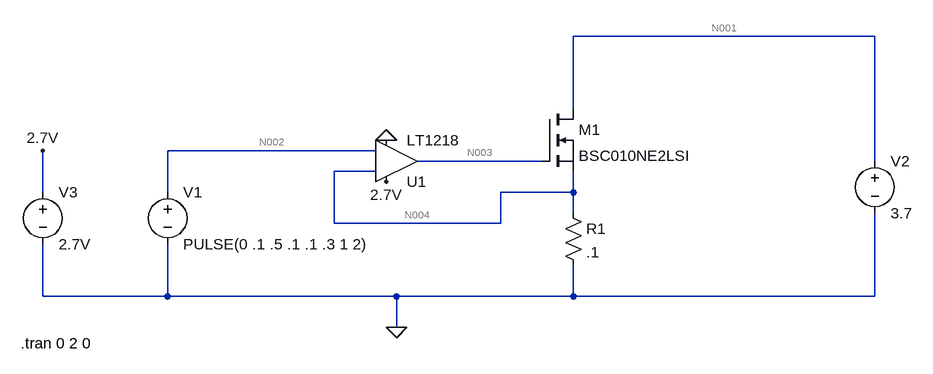
[diagram p0: schematic CurrentSinkOrSwim.asc]
CurrentSinkOrSwim.asc, the LTspice schematic file:
Version 4
SHEET 1 880 680
WIRE 512 -224 48 -224
WIRE 48 -112 48 -224
WIRE -256 -48 -576 -48
WIRE 0 -32 -192 -32
WIRE 512 -32 512 -224
WIRE -256 -16 -320 -16
WIRE -768 16 -768 -48
WIRE -576 16 -576 -48
WIRE 48 16 48 -16
WIRE 48 16 -64 16
WIRE 48 48 48 16
WIRE -320 64 -320 -16
WIRE -64 64 -64 16
WIRE -64 64 -320 64
WIRE -768 176 -768 96
WIRE -576 176 -576 96
WIRE -576 176 -768 176
WIRE -224 176 -576 176
WIRE 48 176 48 128
WIRE 48 176 -224 176
WIRE 512 176 512 48
WIRE 512 176 48 176
WIRE -224 224 -224 176
FLAG -768 -48 2.7V
FLAG -240 0 2.7V
FLAG -224 224 0
FLAG -240 -64 0
SYMBOL voltage -576 0 R0
WINDOW 123 0 0 Left 2
WINDOW 39 0 0 Left 2
SYMATTR InstName V1
SYMATTR Value PULSE(0 .1 .5 .1 .1 .3 1 2)
SYMBOL res 32 32 R0
SYMATTR InstName R1
SYMATTR Value .1
SYMBOL nmos 0 -112 R0
SYMATTR InstName M1
SYMATTR Value BSC010NE2LSI
SYMBOL voltage 512 -48 R0
WINDOW 123 0 0 Left 2
WINDOW 39 0 0 Left 2
SYMATTR InstName V2
SYMATTR Value 3.7
SYMBOL voltage -768 0 R0
WINDOW 123 0 0 Left 2
WINDOW 39 0 0 Left 2
SYMATTR InstName V3
SYMATTR Value 2.7V
SYMBOL Opamps\\LT1218 -224 -32 M180
SYMATTR InstName U1
TEXT -802 248 Left 2 !.tran 0 2 0

The netlist it stands for:
* CurrentSinkOrSwim.asc
V1 N002 0 PULSE(0 .1 .5 .1 .1 .3 1 2)
R1 N004 0 .1
M1 N001 N003 N004 N004 BSC010NE2LSI
V2 N001 0 3.7
V3 2.7V 0 2.7V
XU1 N002 N004 2.7V 0 N003 NC_01 LT1218
.model NMOS NMOS
.model PMOS PMOS
.lib standard.mos
.tran 0 2 0
.lib LTC.lib
.backanno
.end

* Results of the author's LTspice run, read from the files saved beside the schematic
* Operating Point, zero values left out:
*   V(n004) = 7.532 nV
*   V(n001) = 3.7 V
*   V(n003) = 1.331 V
*   V(2.7v) = 2.7 V
*   Id(M1) = 63.19 nA
*   Is(M1) = -63.19 nA
*   I(R1) = 75.32 nA
*   I(V3) = -305.9 µA
*   I(V2) = -63.19 nA
*   I(V1) = 12.13 nA
*   Ix(u1:1) = -12.13 nA
*   Ix(u1:2) = -12.13 nA
*   Ix(u1:3) = 305.9 µA
*   Ix(u1:4) = -305.9 µA
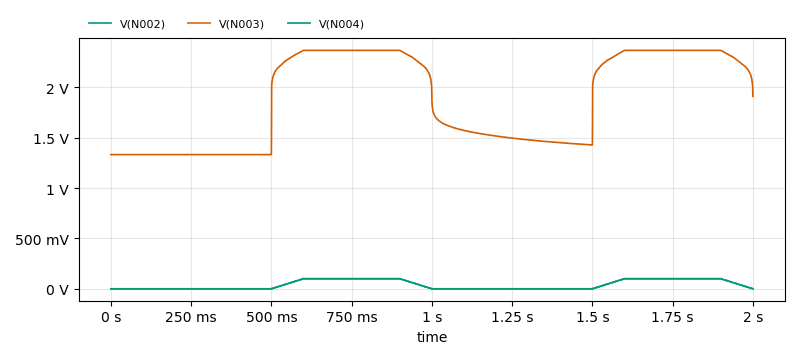
[diagram p1: Transient Analysis of CurrentSinkOrSwim.asc, plotted from the saved traces]
* Transient Analysis, 1 run:
*   V(N002): min 0 V, max 100 mV, average 40 mV, rms 60.85 mV, last 0 V
*   V(N003): min 1.331 V, max 2.365 V, average 1.872 V, rms 1.927 V, last 1.909 V
*   V(N004): min 0 V, max 100 mV, average 40 mV, rms 60.85 mV, last 122.2 µV